# EasyEDA Pro project ProProject_开关电源实验平台_2024-07-17.epro, board PCB8
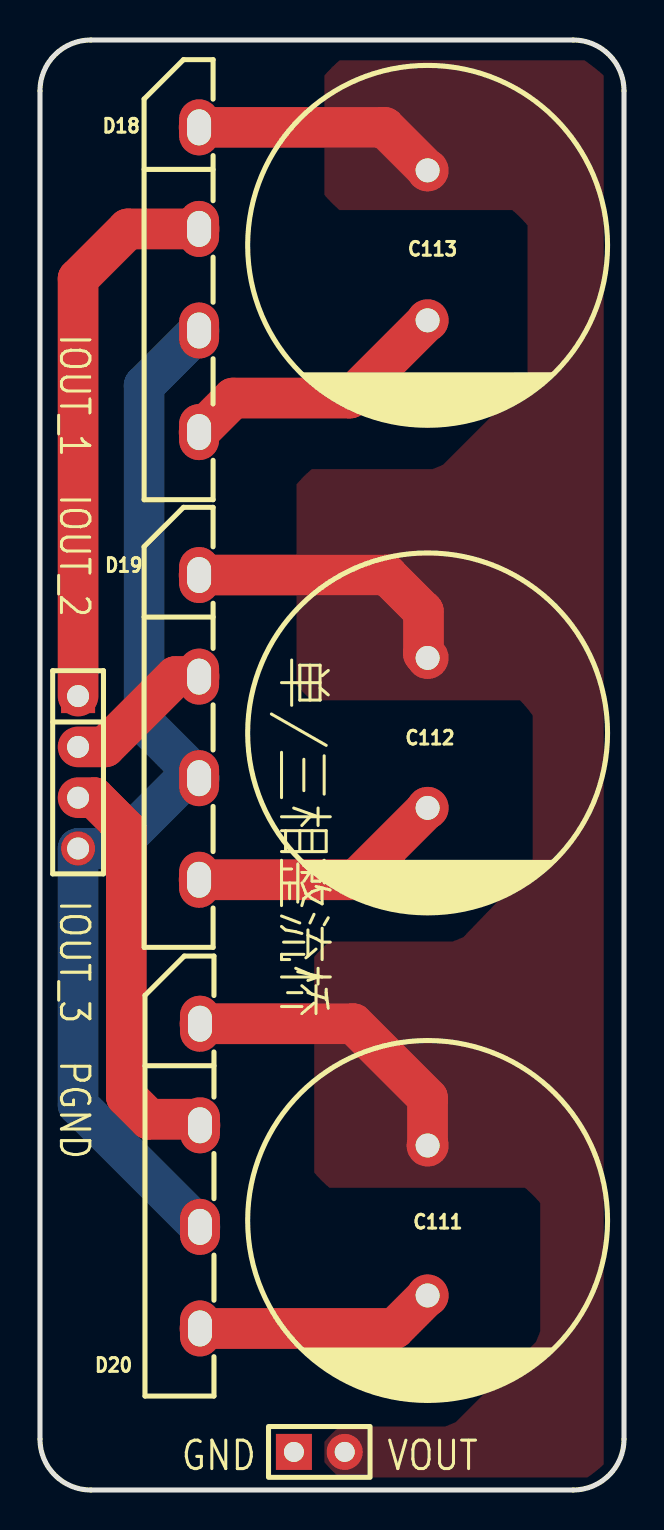
[diagram p6: board, top side]
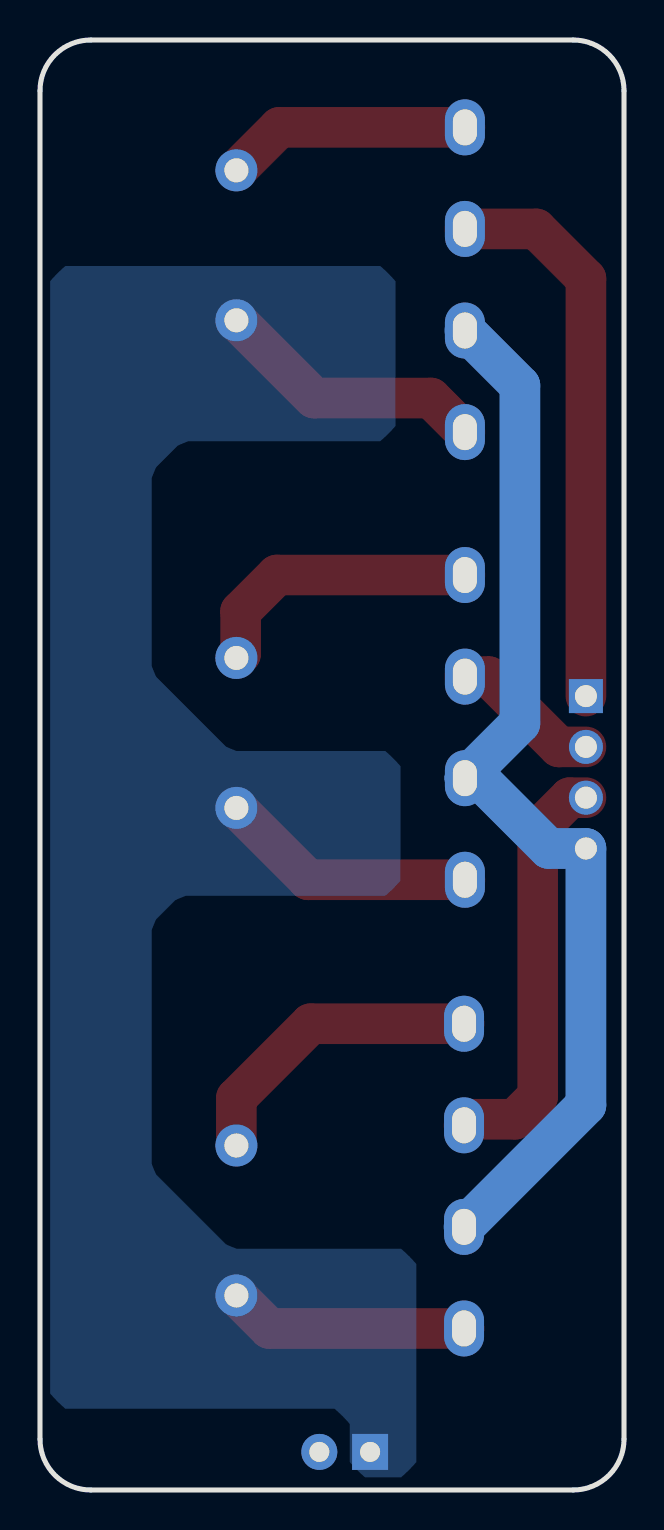
[diagram p7: board, bottom side, seen from below]

Outline 29.21 x 72.52 mm; copper layers: Top Layer, GND, PGND, Bottom Layer. Coordinates in mm from the lower left corner of the outline.
Outline path: 0,69.98 0,2.54 arc(0.74,0.74) 2.54,0 26.67,0 arc(28.47,0.74) 29.21,2.54 29.21,69.98 arc(28.47,71.77) 26.67,72.52 2.54,72.52 arc(0.74,71.77) 0,69.98
Stack: Top Layer 0.035mm 外层铜厚1oz / Dielectric1 0.2104mm 7628 RC49% 8.6mil / GND 0.0152mm 内层铜厚 / Dielectric2 1.065mm 1.1mm H/HOZ 含铜 / PGND 0.0152mm 内层铜厚 / Dielectric3 0.2104mm 7628 RC49% 8.6mil / Bottom Layer 0.035mm 外层铜厚1oz

## Design rules (mm)
template: JLCPCB Capability(Two Layers Board)
spacing copperThickness1oz (default): track to track 0.102, other pairs 0.152 to 0.3
spacing copperThickness2oz: track to track 0.203, other pairs 0.152 to 0.3
track width copperThickness1oz (default): min 0.127, default 0.254, max 2.54
track width copperThickness2oz: min 0.203, default 0.254, max 2.54
differential pair differentialPair (default): width min 0.127, default 0.254, max 2.54; gap min 0.152, default 0.152
via viaSize (default): diameter min 0.5, default 0.61, max 10; hole min 0.3, default 0.305, max 6.3

## Placement (name value [footprint] x y rotation side)
C111  1000uF  [CAP-TH_BD18.0-P7.50-D0.8-FD]  19.39 13.48 270 top
C112  1000uF  [CAP-TH_BD18.0-P7.50-D0.8-FD]  19.39 37.86 270 top
C113  1000uF  [CAP-TH_BD18.0-P7.50-D0.8-FD]  19.39 62.25 270 top
D18  GBU808  [GBU_4P-L22.0-W3.5-P5.08_GBU808]  7.96 60.53 90 top
D19  GBU808  [GBU_4P-L22.0-W3.5-P5.08_GBU808]  7.96 38.14 90 top
D20  GBU808  [GBU_4P-L22.0-W3.5-P5.08_GBU808]  8 15.7 90 top
H1  -  [HDR-TH_4P-P2.54-V-M]  1.91 35.89 270 top
H2  -  [HDR-TH_2P-P2.54-V-M-1]  13.97 1.91 0 top

## Footprints (pads in the part's own frame, mm; a bottom-side part is the same pattern mirrored in y, then rotated)
CAP-TH_BD18.0-P7.50-D0.8-FD
  round 2.1 hole 1.2: 1(-3.75,0) 2(3.75,0)
GBU_4P-L22.0-W3.5-P5.08_GBU808
  oval 2.8x2 hole 1.8x1.2: 1(7.62,0) 2(2.54,0) 3(-2.54,0) 4(-7.62,0)
HDR-TH_2P-P2.54-V-M-1
  rect 1.8x1.8 hole 1: 1(-1.27,0)
  round 1.8 hole 1: 2(1.27,0)
HDR-TH_4P-P2.54-V-M
  rect 1.7x1.7 hole 1.1: 1(-3.81,0)
  round 1.7 hole 1.1: 2(-1.27,0) 3(1.27,0) 4(3.81,0)

## Nets
GND: C111.2 C112.2 C113.2 D18.4 D19.4 D20.4 H2.1
PGND: D18.3 D19.3 D20.3 H1.4
IOUT_1: D18.2 H1.1
IOUT_2: D19.2 H1.2
IOUT_3: D20.2 H1.3
VOUT: C111.1 C112.1 C113.1 D18.1 D19.1 D20.1 H2.2

## Routing (per net, layer and track width the routed paths; a pad name or vN(x,y) marks a point on that pad's centre or on a via; arc(x,y) is an arc through that point)
GND: length 38.7
  Top Layer w2.032: D20.4 17.74,8.08 C111.2 ; C113.2 15.5,54.61 9.66,54.61 D18.4 ; D19.4 15.79,30.52 C112.2
PGND: length 53.6
  Bottom Layer w2.032: D18.3 5.21,55.24 5.21,38.35 D19.3 7.28,35.6 3.76,32.08 H1.4 1.91,19.26 D20.3
IOUT_1: length 28
  Top Layer w2.032: H1.1 1.91,60.58 4.39,63.07 D18.2
IOUT_2: length 7.5
  Top Layer w2.032: H1.2 3.25,37.16 6.77,40.68 D19.2
IOUT_3: length 20.7
  Top Layer w2.032: D20.2 7.7,18.54 5.46,18.54 4.32,19.69 4.32,33.02 2.71,34.62 H1.3
VOUT: length 42
  Top Layer w2.032: C111.1 19.39,19.6 15.67,23.32 D20.1 ; C112.1 19.18,41.82 19.18,43.94 17.36,45.76 D19.1 ; C113.1 17.24,68.15 D18.1

## Copper pours and planes (outline as drawn; the poured copper is in the pictures)
GND on Bottom Layer: 10.39,61.21 28.7,61.21 28.7,0.63 10.39,0.63
GND on GND: 0.26,72.26 28.95,72.26 28.95,0.26 0.26,0.26
PGND on PGND: 0.26,72.26 28.95,72.26 28.95,0.26 0.26,0.26
VOUT on Top Layer: 12.83,71.5 28.19,71.5 28.19,0.63 12.83,0.63

Small or netless copper shapes (teardrops, artwork), in the pictures only: 28 on GND, 16 on PGND

## Text on the board
Top Silkscreen Layer: IOUT_1  IOUT_2 | IOUT_3  PGND | GND | VOUT | 单/三相整流桥
